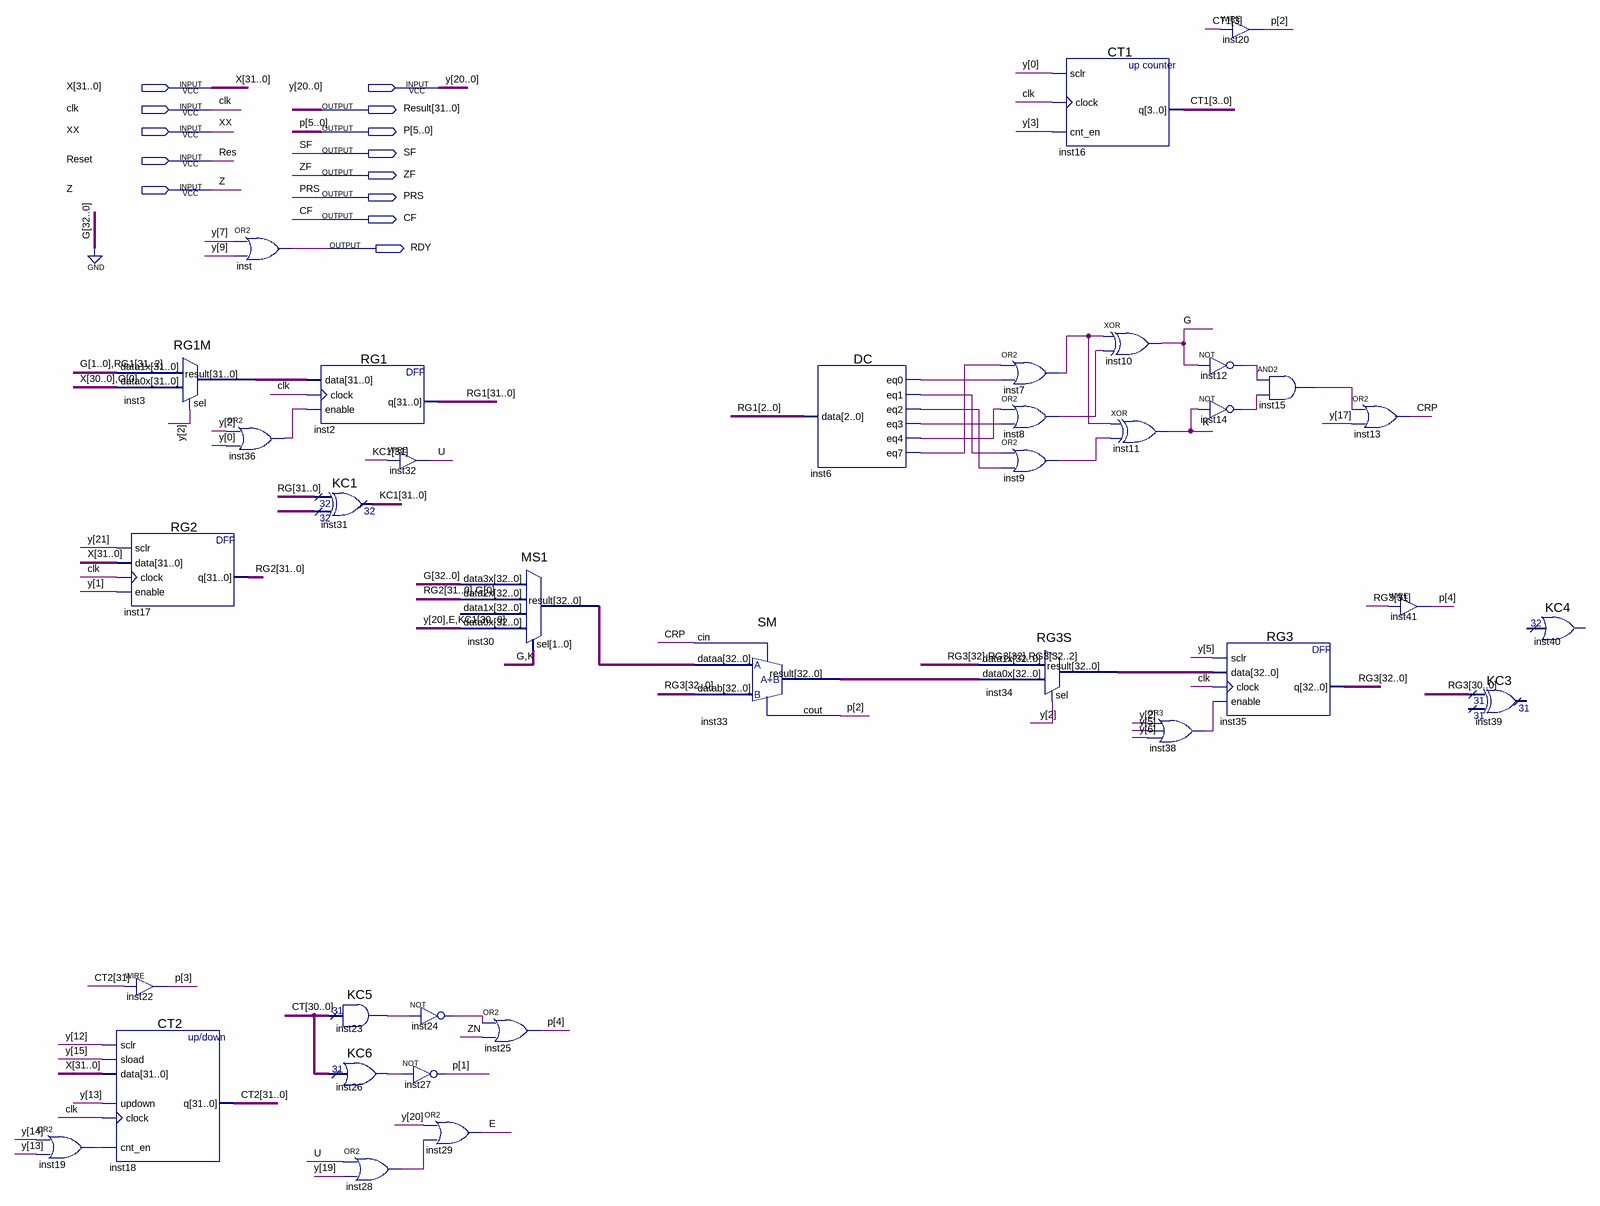
[diagram p0: schematic sheet]
// Quartus schematic gogo.bdf as structural Verilog: 37 symbols, 13 pins
module gogo (
  input  [31:0] X,
  input  [21:0] y,
  input  clk,
  input  XX,
  input  Reset,
  input  Z,
  output [31:0] Result,
  output [5:0] P,
  output SF,
  output ZF,
  output PRS,
  output CF,
  output RDY
);

  wire CRP, E, G, inst6_eq0, inst6_eq1, inst6_eq2, inst6_eq3, inst6_eq4, inst6_eq7, inst7_out, inst8_out,
       inst9_out, inst12_out, inst14_out, inst15_out, inst19_out, inst23_result, inst24_out, inst26_result,
       inst28_out, inst36_out, inst38_out, K, U, ZN;
  wire [3:0] CT1;
  wire [30:0] CT;
  wire [31:0] CT2, inst3_result, KC1, RG, RG1, RG2;
  wire [32:0] inst30_result, inst33_result, inst34_result, RG3;

  or inst19 (inst19_out, y[14], y[13]);
  RG1M inst3 (.data1x({2'b00, RG1[31:2]}), .data0x({X[30:0], 1'b0}), .sel(y[2]), .result(inst3_result));
  RG2 inst17 (.sclr(y[21]), .data(X), .clock(clk), .enable(y[1]), .q(RG2));
  assign P[3] = CT2[31];  // WIRE inst22
  CT2 inst18 (.sclr(y[12]), .sload(y[15]), .data(X), .updown(y[13]), .clock(clk), .cnt_en(inst19_out), .q(CT2));
  or inst (RDY, y[7], y[9]);
  or inst36 (inst36_out, y[2], y[0]);
  RG1 inst2 (.data(inst3_result), .clock(clk), .enable(inst36_out), .q(RG1));
  KC1 inst31 (.data0x(RG), .data1x({32{y[17]}}), .result(KC1));
  KC5 inst23 (.data(CT), .result(inst23_result));
  KC6 inst26 (.data(CT), .result(inst26_result));
  or inst28 (inst28_out, U, y[19]);
  assign U = KC1[31];  // WIRE inst32
  not inst24 (inst24_out, inst23_result);
  not inst27 (P[1], inst26_result);
  MS1 inst30 (
    .data3x({33{1'b0}}), .data2x({RG2, 1'b0}), .data0x({y[20], E, KC1[30:0]}), .sel({G, K}),
    .result(inst30_result));  // open: data1x
  or inst29 (E, y[20], inst28_out);
  or inst25 (P[4], inst24_out, ZN);
  SM inst33 (.dataa(inst30_result), .datab(RG3), .cin(CRP), .result(inst33_result), .cout(P[2]));
  DC inst6 (
    .data(RG1[2:0]), .eq0(inst6_eq0), .eq1(inst6_eq1), .eq2(inst6_eq2), .eq3(inst6_eq3), .eq4(inst6_eq4),
    .eq7(inst6_eq7));
  or inst7 (inst7_out, inst6_eq7, inst6_eq0);
  or inst8 (inst8_out, inst6_eq4, inst6_eq3);
  or inst9 (inst9_out, inst6_eq1, inst6_eq2);
  RG3S inst34 (.data1x({{3{RG3[32]}}, RG3[31:2]}), .data0x(inst33_result), .sel(y[2]), .result(inst34_result));
  CT1 inst16 (.sclr(y[0]), .clock(clk), .cnt_en(y[3]), .q(CT1));
  xor inst10 (G, inst7_out, inst8_out);
  xor inst11 (K, inst7_out, inst9_out);
  or inst38 (inst38_out, y[2], y[5], y[6]);
  assign P[2] = CT1[3];  // WIRE inst20
  not inst12 (inst12_out, G);
  not inst14 (inst14_out, K);
  RG3 inst35 (.sclr(y[5]), .data(inst34_result), .clock(clk), .enable(inst38_out), .q(RG3));
  and inst15 (inst15_out, inst12_out, inst14_out);
  or inst13 (CRP, inst15_out, y[17]);
  assign P[4] = RG3[31];  // WIRE inst41
  KC3 inst39 (.data0x(RG3[30:0]));  // open: data1x, result
  KC4 inst40 ();  // open: data, result

  // Other names for the same wires on the sheet: Res = Reset
endmodule
